# EAGLE design Transport (EAGLE 9.4.2)
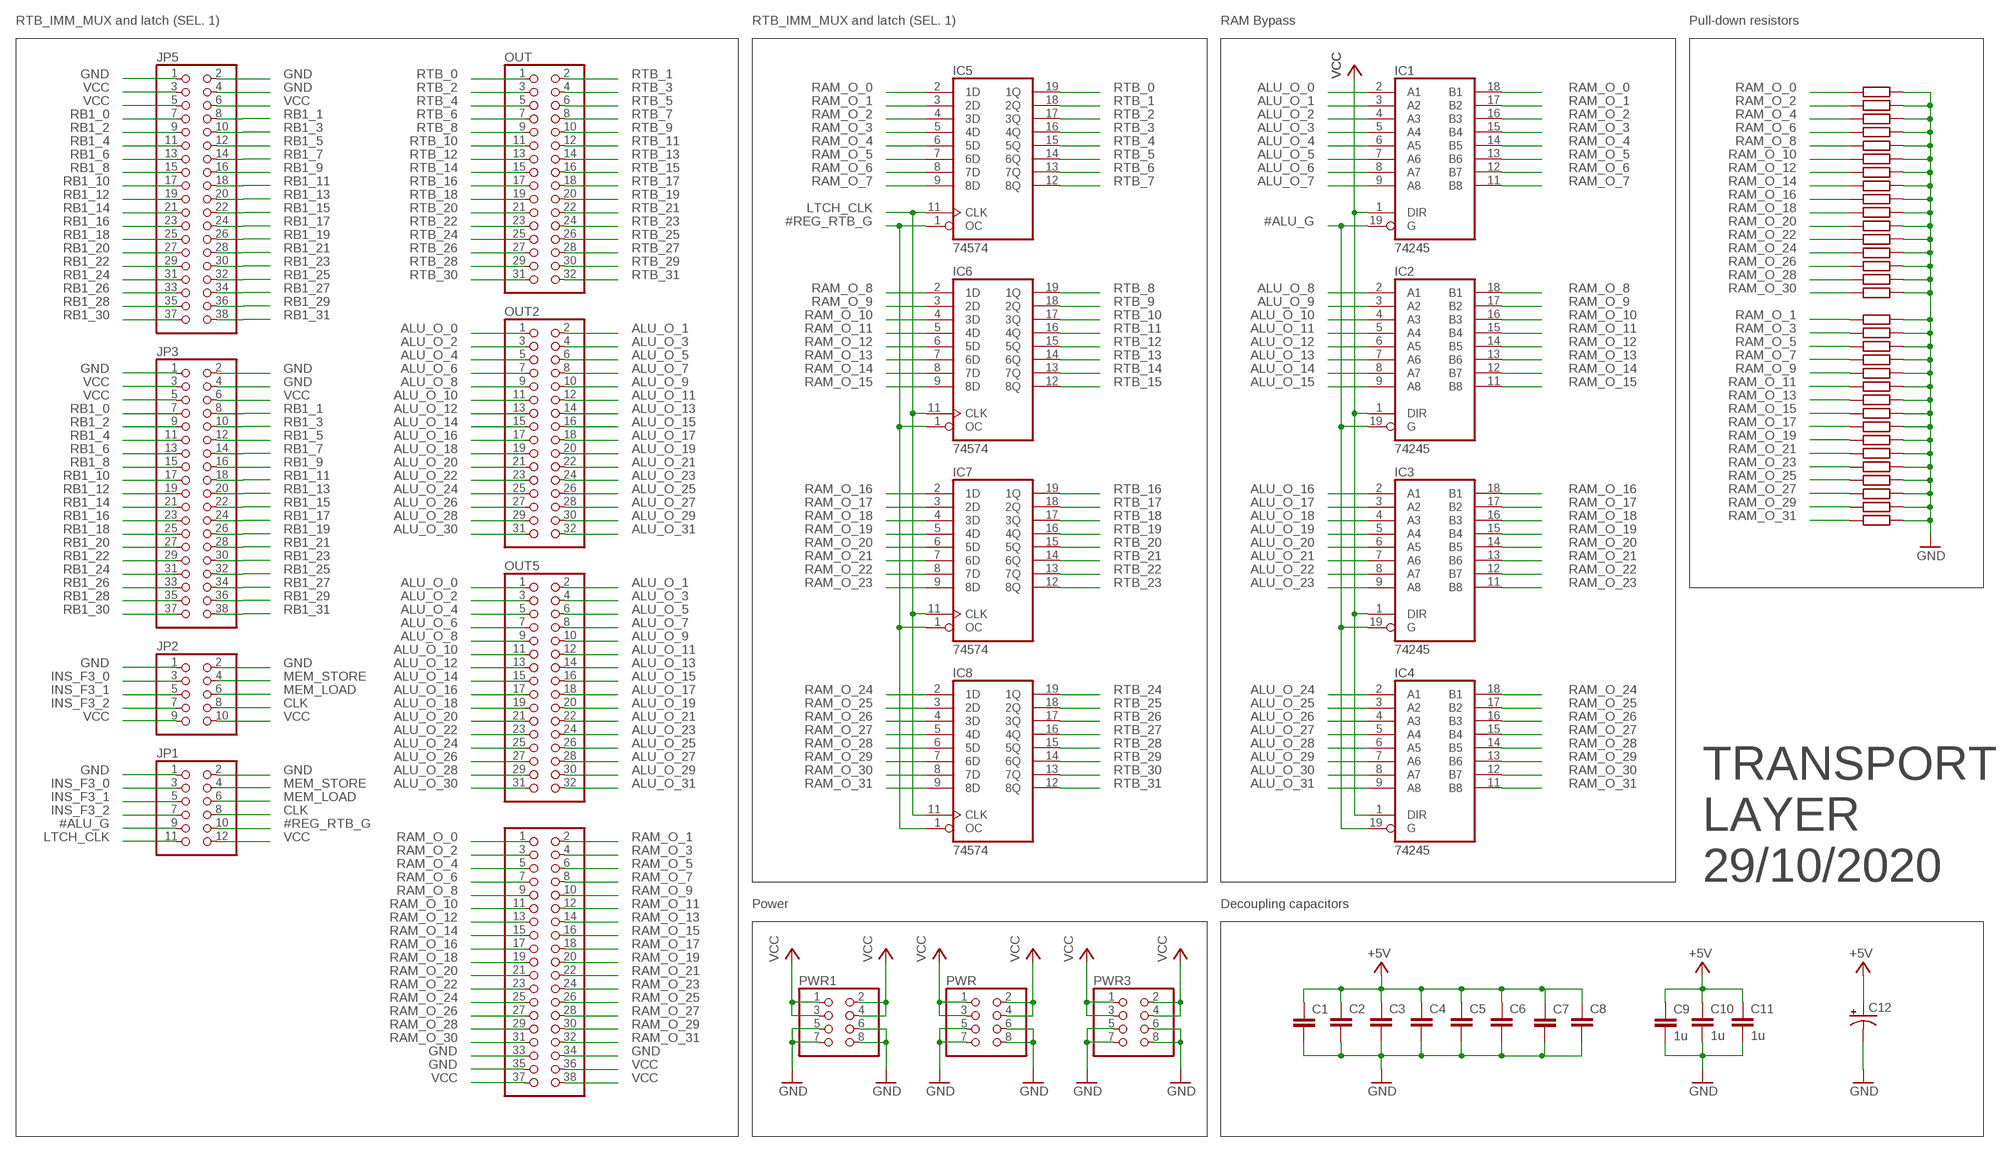
[diagram p0: schematic, sheet 1]

## Parts
C1  C-EUC0805  [C0805]
C2  C-EUC0805  [C0805]
C3  C-EUC0805  [C0805]
C4  C-EUC0805  [C0805]
C5  C-EUC0805  [C0805]
C6  C-EUC0805  [C0805]
C7  C-EUC0805  [C0805]
C8  C-EUC0805  [C0805]
C9  1u  C-EUC0805  [C0805]
C10  1u  C-EUC0805  [C0805]
C11  1u  C-EUC0805  [C0805]
C12  CAPACITOR-P153CLV-1010  [153CLV-1010]
IC1  74245  [TSSOP20]
IC2  74245  [TSSOP20]
IC3  74245  [TSSOP20]
IC4  74245  [TSSOP20]
IC5  74574  [TSSOP20]
IC6  74574  [TSSOP20]
IC7  74574  [TSSOP20]
IC8  74574  [TSSOP20]
JP1  PINHD-2X6  [2X06]
JP2  PINHD-2X5  [2X05]
JP3  PINHD-2X19  [2X19]
JP4  PINHD-2X19  [2X19]
JP5  PINHD-2X19  [2X19]
OUT  PINHD-2X16  [2X16]
OUT2  PINHD-2X16  [2X16]
OUT5  PINHD-2X16  [2X16]
PWR  PINHD-2X4  [2X04]
PWR1  PINHD-2X4  [2X04]
PWR3  PINHD-2X4  [2X04]
R1  R-EU_R0805  [R0805]
R2  R-EU_R0805  [R0805]
R3  R-EU_R0805  [R0805]
R4  R-EU_R0805  [R0805]
R5  R-EU_R0805  [R0805]
R6  R-EU_R0805  [R0805]
R7  R-EU_R0805  [R0805]
R8  R-EU_R0805  [R0805]
R9  R-EU_R0805  [R0805]
R10  R-EU_R0805  [R0805]
R11  R-EU_R0805  [R0805]
R12  R-EU_R0805  [R0805]
R13  R-EU_R0805  [R0805]
R14  R-EU_R0805  [R0805]
R15  R-EU_R0805  [R0805]
R16  R-EU_R0805  [R0805]
R17  R-EU_R0805  [R0805]
R18  R-EU_R0805  [R0805]
R19  R-EU_R0805  [R0805]
R20  R-EU_R0805  [R0805]
R21  R-EU_R0805  [R0805]
R22  R-EU_R0805  [R0805]
R23  R-EU_R0805  [R0805]
R24  R-EU_R0805  [R0805]
R25  R-EU_R0805  [R0805]
R26  R-EU_R0805  [R0805]
R27  R-EU_R0805  [R0805]
R28  R-EU_R0805  [R0805]
R29  R-EU_R0805  [R0805]
R30  R-EU_R0805  [R0805]
R31  R-EU_R0805  [R0805]
R33  R-EU_R0805  [R0805]

## Nets
#ALU_G: IC1.19(G) IC2.19(G) IC3.19(G) IC4.19(G) JP1.9
#REG_RTB_G: IC5.1(OC) IC6.1(OC) IC7.1(OC) IC8.1(OC) JP1.10
ALU_O_0: IC1.2(A1) OUT2.1 OUT5.1
ALU_O_1: IC1.3(A2) OUT2.2 OUT5.2
ALU_O_2: IC1.4(A3) OUT2.3 OUT5.3
ALU_O_3: IC1.5(A4) OUT2.4 OUT5.4
ALU_O_4: IC1.6(A5) OUT2.5 OUT5.5
ALU_O_5: IC1.7(A6) OUT2.6 OUT5.6
ALU_O_6: IC1.8(A7) OUT2.7 OUT5.7
ALU_O_7: IC1.9(A8) OUT2.8 OUT5.8
ALU_O_8: IC2.2(A1) OUT2.9 OUT5.9
ALU_O_9: IC2.3(A2) OUT2.10 OUT5.10
ALU_O_10: IC2.4(A3) OUT2.11 OUT5.11
ALU_O_11: IC2.5(A4) OUT2.12 OUT5.12
ALU_O_12: IC2.6(A5) OUT2.13 OUT5.13
ALU_O_13: IC2.7(A6) OUT2.14 OUT5.14
ALU_O_14: IC2.8(A7) OUT2.15 OUT5.15
ALU_O_15: IC2.9(A8) OUT2.16 OUT5.16
ALU_O_16: IC3.2(A1) OUT2.17 OUT5.17
ALU_O_17: IC3.3(A2) OUT2.18 OUT5.18
ALU_O_18: IC3.4(A3) OUT2.19 OUT5.19
ALU_O_19: IC3.5(A4) OUT2.20 OUT5.20
ALU_O_20: IC3.6(A5) OUT2.21 OUT5.21
ALU_O_21: IC3.7(A6) OUT2.22 OUT5.22
ALU_O_22: IC3.8(A7) OUT2.23 OUT5.23
ALU_O_23: IC3.9(A8) OUT2.24 OUT5.24
ALU_O_24: IC4.2(A1) OUT2.25 OUT5.25
ALU_O_25: IC4.3(A2) OUT2.26 OUT5.26
ALU_O_26: IC4.4(A3) OUT2.27 OUT5.27
ALU_O_27: IC4.5(A4) OUT2.28 OUT5.28
ALU_O_28: IC4.6(A5) OUT2.29 OUT5.29
ALU_O_29: IC4.7(A6) OUT2.30 OUT5.30
ALU_O_30: IC4.8(A7) OUT2.31 OUT5.31
ALU_O_31: IC4.9(A8) OUT2.32 OUT5.32
CLK: JP1.8 JP2.8
GND: C1.2 C2.2 C3.2 C4.2 C5.2 C6.2 C7.2 C8.2 C9.2 C10.2 C11.2 C12.- JP1.1 JP1.2 JP2.1 JP2.2 JP3.1 JP3.2 JP3.4 JP4.33 JP4.34 JP4.35 JP5.1 JP5.2 JP5.4 PWR1.5 PWR1.6 PWR1.7 PWR1.8 PWR3.5 PWR3.6 PWR3.7 PWR3.8 PWR.5 PWR.6 PWR.7 PWR.8 R1.2 R2.2 R3.2 R4.2 R5.2 R6.2 R7.2 R8.2 R9.2 R10.2 R11.2 R12.2 R13.2 R14.2 R15.2 R16.2 R17.2 R18.2 R19.2 R20.2 R21.2 R22.2 R23.2 R24.2 R25.2 R26.2 R27.2 R28.2 R29.2 R30.2 R31.2 R33.2
INS_F3_0: JP1.3 JP2.3
INS_F3_1: JP1.5 JP2.5
INS_F3_2: JP1.7 JP2.7
LTCH_CLK: IC5.11(CLK) IC6.11(CLK) IC7.11(CLK) IC8.11(CLK) JP1.11
MEM_LOAD: JP1.6 JP2.6
MEM_STORE: JP1.4 JP2.4
RAM_O_0: IC1.18(B1) IC5.2(1D) JP4.1 R33.1
RAM_O_1: IC1.17(B2) IC5.3(2D) JP4.2 R16.1
RAM_O_2: IC1.16(B3) IC5.4(3D) JP4.3 R1.1
RAM_O_3: IC1.15(B4) IC5.5(4D) JP4.4 R17.1
RAM_O_4: IC1.14(B5) IC5.6(5D) JP4.5 R2.1
RAM_O_5: IC1.13(B6) IC5.7(6D) JP4.6 R18.1
RAM_O_6: IC1.12(B7) IC5.8(7D) JP4.7 R3.1
RAM_O_7: IC1.11(B8) IC5.9(8D) JP4.8 R19.1
RAM_O_8: IC2.18(B1) IC6.2(1D) JP4.9 R4.1
RAM_O_9: IC2.17(B2) IC6.3(2D) JP4.10 R20.1
RAM_O_10: IC2.16(B3) IC6.4(3D) JP4.11 R5.1
RAM_O_11: IC2.15(B4) IC6.5(4D) JP4.12 R21.1
RAM_O_12: IC2.14(B5) IC6.6(5D) JP4.13 R6.1
RAM_O_13: IC2.13(B6) IC6.7(6D) JP4.14 R22.1
RAM_O_14: IC2.12(B7) IC6.8(7D) JP4.15 R7.1
RAM_O_15: IC2.11(B8) IC6.9(8D) JP4.16 R23.1
RAM_O_16: IC3.18(B1) IC7.2(1D) JP4.17 R8.1
RAM_O_17: IC3.17(B2) IC7.3(2D) JP4.18 R24.1
RAM_O_18: IC3.16(B3) IC7.4(3D) JP4.19 R9.1
RAM_O_19: IC3.15(B4) IC7.5(4D) JP4.20 R25.1
RAM_O_20: IC3.14(B5) IC7.6(5D) JP4.21 R10.1
RAM_O_21: IC3.13(B6) IC7.7(6D) JP4.22 R26.1
RAM_O_22: IC3.12(B7) IC7.8(7D) JP4.23 R11.1
RAM_O_23: IC3.11(B8) IC7.9(8D) JP4.24 R27.1
RAM_O_24: IC4.18(B1) IC8.2(1D) JP4.25 R12.1
RAM_O_25: IC4.17(B2) IC8.3(2D) JP4.26 R28.1
RAM_O_26: IC4.16(B3) IC8.4(3D) JP4.27 R13.1
RAM_O_27: IC4.15(B4) IC8.5(4D) JP4.28 R29.1
RAM_O_28: IC4.14(B5) IC8.6(5D) JP4.29 R14.1
RAM_O_29: IC4.13(B6) IC8.7(6D) JP4.30 R30.1
RAM_O_30: IC4.12(B7) IC8.8(7D) JP4.31 R15.1
RAM_O_31: IC4.11(B8) IC8.9(8D) JP4.32 R31.1
RB1_0: JP3.7 JP5.7
RB1_1: JP3.8 JP5.8
RB1_2: JP3.9 JP5.9
RB1_3: JP3.10 JP5.10
RB1_4: JP3.11 JP5.11
RB1_5: JP3.12 JP5.12
RB1_6: JP3.13 JP5.13
RB1_7: JP3.14 JP5.14
RB1_8: JP3.15 JP5.15
RB1_9: JP3.16 JP5.16
RB1_10: JP3.17 JP5.17
RB1_11: JP3.18 JP5.18
RB1_12: JP3.19 JP5.19
RB1_13: JP3.20 JP5.20
RB1_14: JP3.21 JP5.21
RB1_15: JP3.22 JP5.22
RB1_16: JP3.23 JP5.23
RB1_17: JP3.24 JP5.24
RB1_18: JP3.25 JP5.25
RB1_19: JP3.26 JP5.26
RB1_20: JP3.27 JP5.27
RB1_21: JP3.28 JP5.28
RB1_22: JP3.29 JP5.29
RB1_23: JP3.30 JP5.30
RB1_24: JP3.31 JP5.31
RB1_25: JP3.32 JP5.32
RB1_26: JP3.33 JP5.33
RB1_27: JP3.34 JP5.34
RB1_28: JP3.35 JP5.35
RB1_29: JP3.36 JP5.36
RB1_30: JP3.37 JP5.37
RB1_31: JP3.38 JP5.38
RTB_0: IC5.19(1Q) OUT.1
RTB_1: IC5.18(2Q) OUT.2
RTB_2: IC5.17(3Q) OUT.3
RTB_3: IC5.16(4Q) OUT.4
RTB_4: IC5.15(5Q) OUT.5
RTB_5: IC5.14(6Q) OUT.6
RTB_6: IC5.13(7Q) OUT.7
RTB_7: IC5.12(8Q) OUT.8
RTB_8: IC6.19(1Q) OUT.9
RTB_9: IC6.18(2Q) OUT.10
RTB_10: IC6.17(3Q) OUT.11
RTB_11: IC6.16(4Q) OUT.12
RTB_12: IC6.15(5Q) OUT.13
RTB_13: IC6.14(6Q) OUT.14
RTB_14: IC6.13(7Q) OUT.15
RTB_15: IC6.12(8Q) OUT.16
RTB_16: IC7.19(1Q) OUT.17
RTB_17: IC7.18(2Q) OUT.18
RTB_18: IC7.17(3Q) OUT.19
RTB_19: IC7.16(4Q) OUT.20
RTB_20: IC7.15(5Q) OUT.21
RTB_21: IC7.14(6Q) OUT.22
RTB_22: IC7.13(7Q) OUT.23
RTB_23: IC7.12(8Q) OUT.24
RTB_24: IC8.19(1Q) OUT.25
RTB_25: IC8.18(2Q) OUT.26
RTB_26: IC8.17(3Q) OUT.27
RTB_27: IC8.16(4Q) OUT.28
RTB_28: IC8.15(5Q) OUT.29
RTB_29: IC8.14(6Q) OUT.30
RTB_30: IC8.13(7Q) OUT.31
RTB_31: IC8.12(8Q) OUT.32
VCC: C1.1 C2.1 C3.1 C4.1 C5.1 C6.1 C7.1 C8.1 C9.1 C10.1 C11.1 C12.+ IC1.1(DIR) IC2.1(DIR) IC3.1(DIR) IC4.1(DIR) JP1.12 JP2.9 JP2.10 JP3.3 JP3.5 JP3.6 JP4.36 JP4.37 JP4.38 JP5.3 JP5.5 JP5.6 PWR1.1 PWR1.2 PWR1.3 PWR1.4 PWR3.1 PWR3.2 PWR3.3 PWR3.4 PWR.1 PWR.2 PWR.3 PWR.4 ; supply symbol labelled +5V

## Notes on the sheet
- RTB_IMM_MUX and latch (SEL. 1) | RTB_IMM_MUX and latch (SEL. 1) | RAM Bypass | Pull-down resistors
- TRANSPORT
  LAYER
  29/10/2020
- Power | Decoupling capacitors

## Power pins joined to a net without a drawn wire
GND: IC1.10(GND) IC2.10(GND) IC3.10(GND) IC4.10(GND) IC5.10(GND) IC6.10(GND) IC7.10(GND) IC8.10(GND)
VCC: IC1.20(VCC) IC2.20(VCC) IC3.20(VCC) IC4.20(VCC) IC5.20(VCC) IC6.20(VCC) IC7.20(VCC) IC8.20(VCC)

## Library data of the parts
C1-C11 = rcl:C-EU: CAPACITOR, European symbol; SPICEPREFIX: C
C12 = BeagleBone_Blue_R3:CAPACITOR-P: POLARIZED CAPACITOR, American symbol
IC1-IC4 = AAA__74xx-eu:74*245: Octal BUS TRANSCEIVER, 3-state
IC5-IC8 = AAA__74xx-eu:74*574: 8-bit D type FLIP FLOP bus driver
JP1 = pinhead_bottom:PINHD-2X6: PIN HEADER
JP2 = Connector:PINHD-2X5: PIN HEADER; CATEGORY: CONNECTOR; SUB-CATEGORY: PIN-HEADER
JP3 = pinhead_bottom:PINHD-2X19: PIN HEADER
JP4 JP5 = pinhead:PINHD-2X19: PIN HEADER
OUT OUT5 = pinhead_bottom:PINHD-2X16: PIN HEADER
OUT2 = pinhead:PINHD-2X16: PIN HEADER
PWR PWR3 = pinhead_bottom:PINHD-2X4: PIN HEADER
PWR1 = pinhead:PINHD-2X4: PIN HEADER
R1-R31 R33 = rcl:R-EU_: RESISTOR, European symbol; SPICEPREFIX: R

## Board
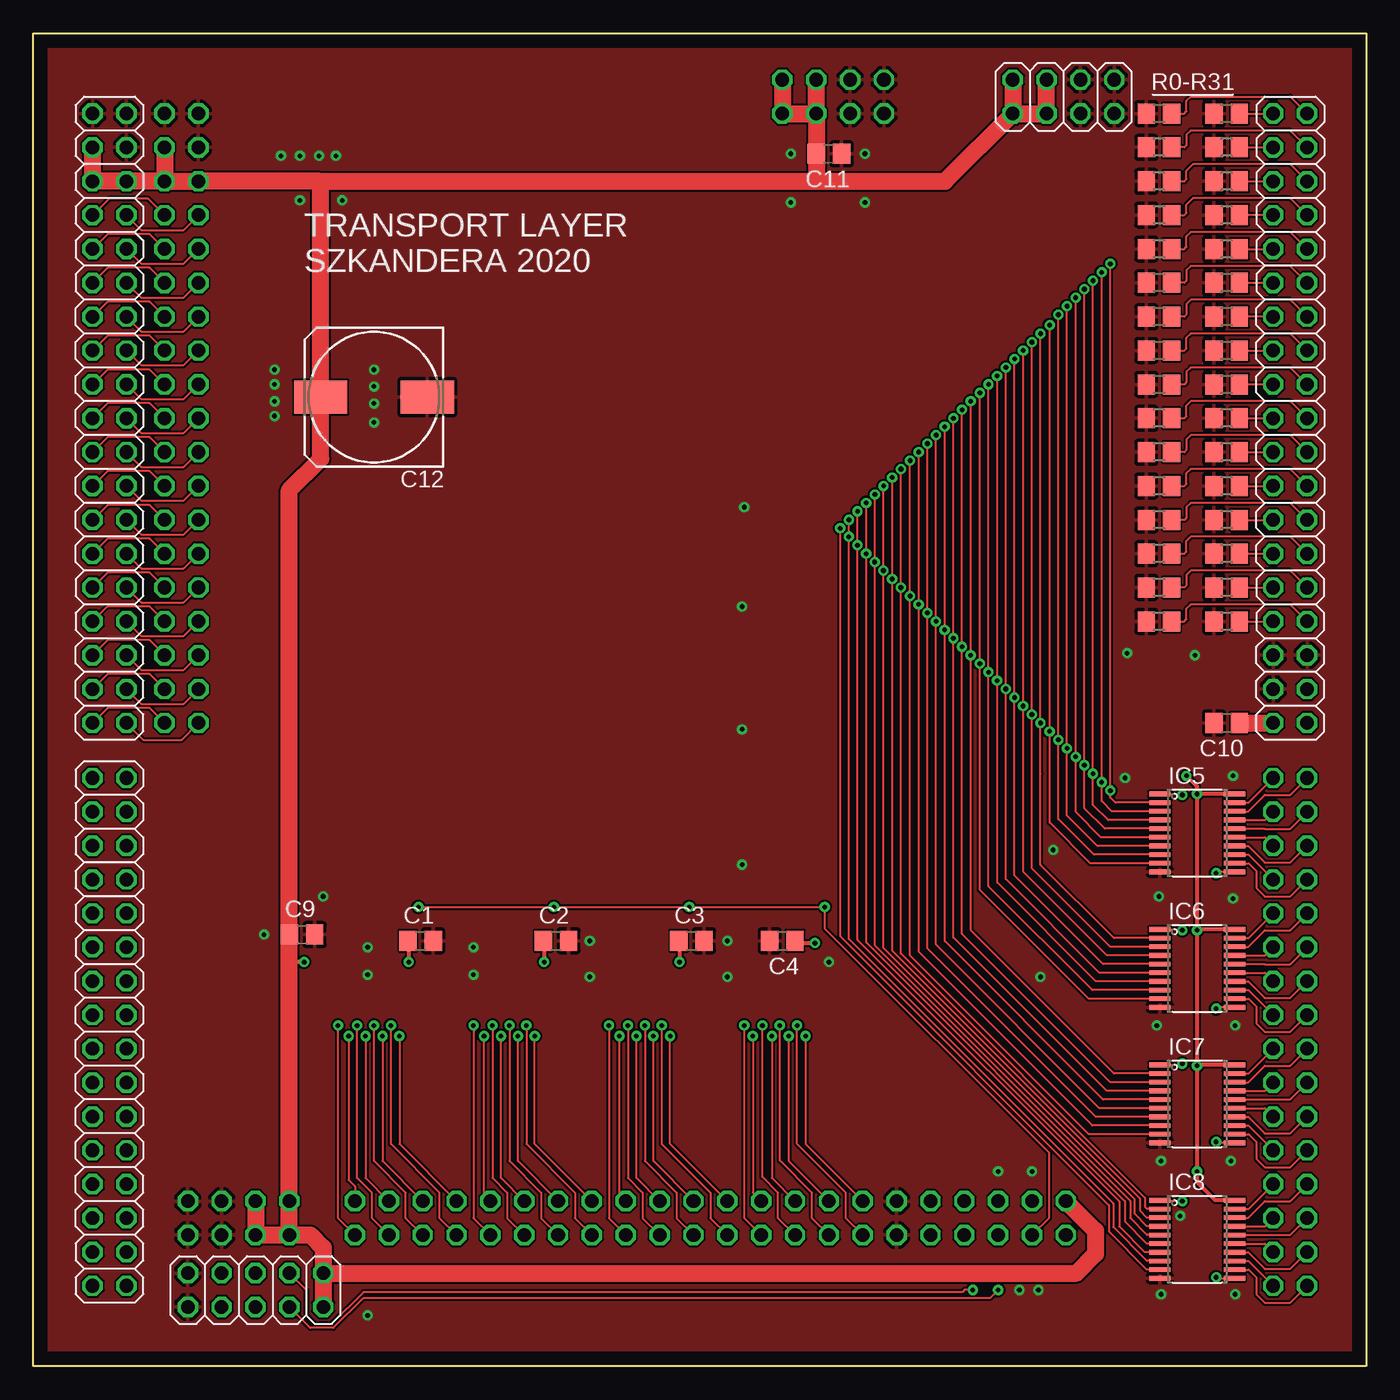
[diagram p1: board, top side]
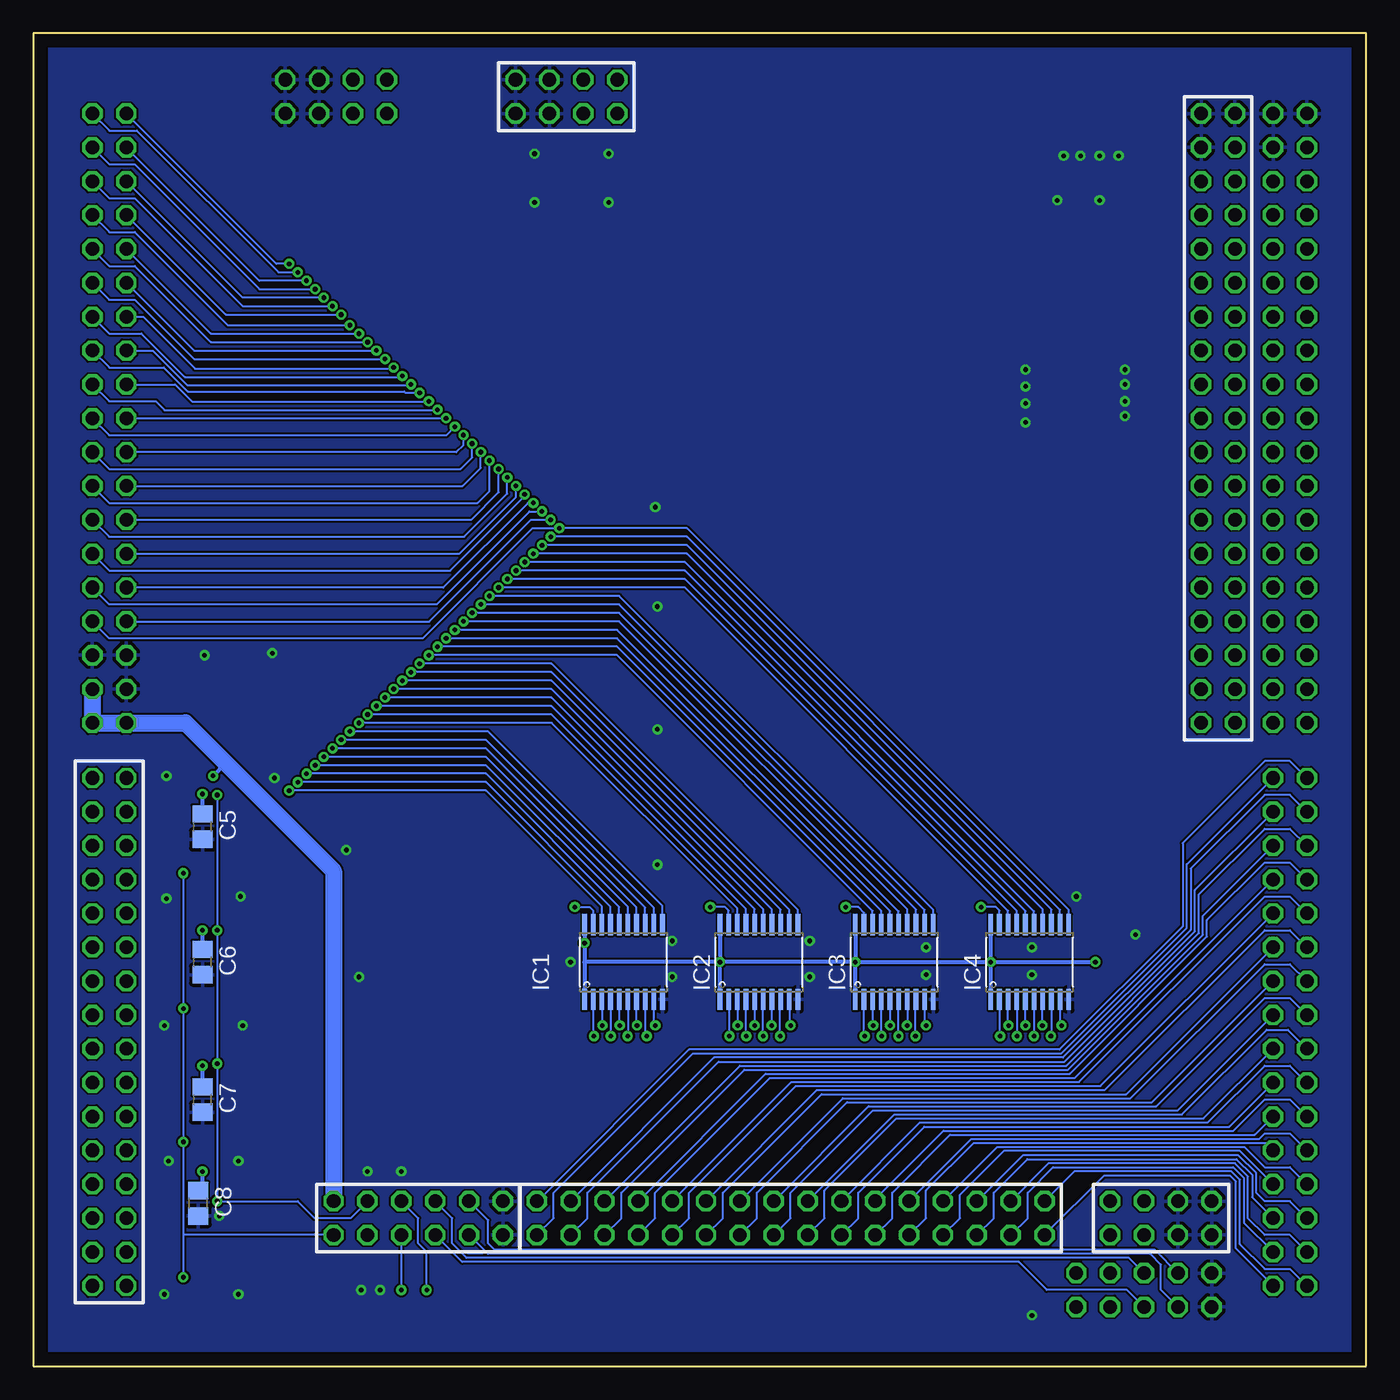
[diagram p2: board, bottom side, seen from below]

Size 100 x 100 mm. Coordinates in mm from the lower left corner, seen from the top.
Outline: 0,0 0,100 100,100 100,0 0,0
Copper layers (1*16): Top 0.035mm / dielectric 1.5mm / Bottom 0.035mm
Design rules "default": minimum track width 6mil, minimum drill 0.35mm, track to track 6mil, track to pad 6mil, pad to pad 6mil, via to via 6mil, smd to smd 6mil, copper to edge 40mil, drill to drill 6mil, minimum pad ring 10mil, minimum via ring 8mil, stop-mask expansion 4mil, vias tented up to drill 0mil, thermal gap 10mil

### Footprints (pad centres in the part's own frame; a part is rotated, then mirrored left to right if it is on the bottom)
C0805 = smd 1.3 x 1.5: 1 -0.95,0; 2 0.95,0
153CLV-1010 = smd 4 x 2.5: + 4,0; - -4,0
TSSOP20 = smd 0.35 x 1.6: 1 -2.925,-2.8; 2 -2.275,-2.8; 3 -1.625,-2.8; 4 -0.975,-2.8; 5 -0.325,-2.8; 6 0.325,-2.8; 7 0.975,-2.8; 8 1.625,-2.8; 9 2.275,-2.8; 10 2.925,-2.8; 11 2.925,2.8; 12 2.275,2.8; 13 1.625,2.8; 14 0.975,2.8; 15 0.325,2.8; 16 -0.325,2.8; 17 -0.975,2.8; 18 -1.625,2.8; 19 -2.275,2.8; 20 -2.925,2.8
2X06 = drill 1.016 octagon: 1 -6.35,-1.27; 2 -6.35,1.27; 3 -3.81,-1.27; 4 -3.81,1.27; 5 -1.27,-1.27; 6 -1.27,1.27; 7 1.27,-1.27; 8 1.27,1.27; 9 3.81,-1.27; 10 3.81,1.27; 11 6.35,-1.27; 12 6.35,1.27
2X05 = drill 1.016 octagon: 1 -5.08,-1.27; 2 -5.08,1.27; 3 -2.54,-1.27; 4 -2.54,1.27; 5 0,-1.27; 6 0,1.27; 7 2.54,-1.27; 8 2.54,1.27; 9 5.08,-1.27; 10 5.08,1.27
2X19 = drill 1.016 octagon: 1 -22.86,-1.27; 2 -22.86,1.27; 3 -20.32,-1.27; 4 -20.32,1.27; 5 -17.78,-1.27; 6 -17.78,1.27; 7 -15.24,-1.27; 8 -15.24,1.27; 9 -12.7,-1.27; 10 -12.7,1.27; 11 -10.16,-1.27; 12 -10.16,1.27; 13 -7.62,-1.27; 14 -7.62,1.27; 15 -5.08,-1.27; 16 -5.08,1.27; 17 -2.54,-1.27; 18 -2.54,1.27; 19 0,-1.27; 20 0,1.27; 21 2.54,-1.27; 22 2.54,1.27; 23 5.08,-1.27; 24 5.08,1.27; 25 7.62,-1.27; 26 7.62,1.27; 27 10.16,-1.27; 28 10.16,1.27; 29 12.7,-1.27; 30 12.7,1.27; 31 15.24,-1.27; 32 15.24,1.27; 33 17.78,-1.27; 34 17.78,1.27; 35 20.32,-1.27; 36 20.32,1.27; 37 22.86,-1.27; 38 22.86,1.27
2X16 = drill 1.016 octagon: 1 -19.05,-1.27; 2 -19.05,1.27; 3 -16.51,-1.27; 4 -16.51,1.27; 5 -13.97,-1.27; 6 -13.97,1.27; 7 -11.43,-1.27; 8 -11.43,1.27; 9 -8.89,-1.27; 10 -8.89,1.27; 11 -6.35,-1.27; 12 -6.35,1.27; 13 -3.81,-1.27; 14 -3.81,1.27; 15 -1.27,-1.27; 16 -1.27,1.27; 17 1.27,-1.27; 18 1.27,1.27; 19 3.81,-1.27; 20 3.81,1.27; 21 6.35,-1.27; 22 6.35,1.27; 23 8.89,-1.27; 24 8.89,1.27; 25 11.43,-1.27; 26 11.43,1.27; 27 13.97,-1.27; 28 13.97,1.27; 29 16.51,-1.27; 30 16.51,1.27; 31 19.05,-1.27; 32 19.05,1.27
2X04 = drill 1.016 octagon: 1 -3.81,-1.27; 2 -3.81,1.27; 3 -1.27,-1.27; 4 -1.27,1.27; 5 1.27,-1.27; 6 1.27,1.27; 7 3.81,-1.27; 8 3.81,1.27
R0805 = smd 1.3 x 1.5: 1 -0.95,0; 2 0.95,0

### Placement (x,y rotation side)
C1  29.05,31.91 0 top
C2  39.21,31.91 0 top
C3  49.37,31.91 0 top
C4  56.2,31.91 180 top
C5  87.31,40.48 270 bottom
C6  87.31,30.32 270 bottom
C7  87.31,20 270 bottom
C8  87.63,12.22 270 bottom
C9  20.16,32.38 0 top
C10  89.53,48.26 180 top
C11  59.69,90.96 0 top
C12  25.56,72.71 180 top
IC1  55.72,30.32 0 bottom
IC2  45.56,30.32 0 bottom
IC3  35.4,30.32 0 bottom
IC4  25.24,30.32 0 bottom
IC5  87.31,40.01 270 top
IC6  87.31,29.84 270 top
IC7  87.31,19.68 270 top
IC8  87.31,9.53 270 top
JP1  71.12,11.11 0 top
JP2  16.67,5.71 0 top
JP3  11.11,71.12 270 top
JP4  94.3,71.12 270 top
JP5  5.71,71.12 270 top
OUT  94.3,25.08 270 top
OUT2  5.71,25.08 270 top
OUT5  43.18,11.11 180 top
PWR  15.4,11.11 180 top
PWR1  77.29,95.25 0 top
PWR3  60.01,95.25 0 top
R1  89.53,91.44 180 top
R2  89.53,88.9 180 top
R3  89.53,86.36 180 top
R4  89.53,83.82 180 top
R5  89.53,81.28 180 top
R6  89.53,78.74 180 top
R7  89.53,76.2 180 top
R8  89.53,73.66 180 top
R9  89.53,71.12 180 top
R10  89.53,68.58 180 top
R11  89.53,66.04 180 top
R12  89.53,63.5 180 top
R13  89.53,60.96 180 top
R14  89.53,58.42 180 top
R15  89.53,55.88 180 top
R16  84.45,93.98 180 top
R17  84.45,91.44 180 top
R18  84.45,88.9 180 top
R19  84.45,86.36 180 top
R20  84.45,83.82 180 top
R21  84.45,81.28 180 top
R22  84.45,78.74 180 top
R23  84.45,76.2 180 top
R24  84.45,73.66 180 top
R25  84.45,71.12 180 top
R26  84.45,68.58 180 top
R27  84.45,66.04 180 top
R28  84.45,63.5 180 top
R29  84.45,60.96 180 top
R30  84.45,58.42 180 top
R31  84.45,55.88 180 top
R33  89.53,93.98 180 top

### Tracks (layer width: path | path; a pad name or v marks a point on that pad's centre or on a via)
#ALU_G  (via drill 0.35)
  Top 0.152: v28.89,34.45 v39.05,34.45 v49.21,34.45 v59.37,34.45 59.37,32.86 76.2,16.03 76.2,11.11 JP1.9
  Bottom 0.152: IC4.19 27.52,34.18 27.78,34.45 v28.89,34.45 | v59.37,34.45 58.26,34.45 58,34.18 IC1.19 | IC2.19 47.84,34.18 48.1,34.45 v49.21,34.45 | IC3.19 37.68,34.02 38.1,34.45 v39.05,34.45
#REG_RTB_G  (via drill 0.35)
  Top 0.152: IC5.1 86.13,42.93 v86.2,42.86 | v86.2,12.38 84.58,12.38 IC8.1 | IC7.1 86.11,22.61 v86.2,22.7 | IC6.1 86.13,32.77 v86.2,32.7
  Bottom 0.152: v86.2,42.86 v86.2,32.7 v86.2,22.7 v86.2,12.38 80.17,12.38 78.9,11.11 76.2,11.11 JP1.10
ALU_O_0  (via drill 0.35)
  Top 0.152: v57.94,24.77 57.94,16.67 OUT5.1
  Bottom 0.152: OUT2.1 5.71,45.4 7.62,45.4 13.77,39.26 13.77,33 23,23.76 50.81,23.76 62.19,12.38 OUT5.1 | IC1.2 58,24.82 v57.94,24.77
ALU_O_1  (via drill 0.35)
  Top 0.152: OUT5.2 60.96,11.11 60.96,13.02 57.31,16.67 v57.31,25.56
  Bottom 0.152: OUT5.2 60.96,11.11 60.96,13.02 50.52,23.46 22.88,23.46 13.46,32.87 13.46,37.66 OUT2.2 | v57.31,25.56 57.31,27.48 IC1.3
ALU_O_2  (via drill 0.35)
  Top 0.152: v56.67,24.77 56.67,15.4 OUT5.3
  Bottom 0.152: OUT2.3 5.71,42.86 7.62,42.86 13.16,37.33 13.16,32.75 22.75,23.15 48.92,23.15 OUT5.3 | IC1.4 56.7,24.79 v56.67,24.77
ALU_O_3  (via drill 0.35)
  Top 0.152: OUT5.4 58.42,11.11 58.42,13.02 56,15.43 56,24.51 56.01,24.51 56.01,25.02 56,25.02 v56,25.56
  Bottom 0.152: OUT5.4 58.42,11.11 58.42,13.02 48.59,22.85 22.63,22.85 12.85,32.62 12.85,35.73 OUT2.4 | v56,25.56 56,27.48 IC1.5
ALU_O_4  (via drill 0.35)
  Top 0.152: v55.4,24.77 55.4,14.13 OUT5.5
  Bottom 0.152: OUT5.5 46.99,22.54 22.5,22.54 12.55,32.49 12.55,35.4 7.62,40.32 5.71,40.32 OUT2.5 | IC1.6 v55.4,24.77
ALU_O_5  (via drill 0.35)
  Top 0.152: OUT5.6 55.88,11.11 55.88,13.02 54.7,14.19 v54.7,25.56
  Bottom 0.152: OUT5.6 55.88,11.11 55.88,13.02 46.66,22.24 22.37,22.24 12.24,32.37 12.24,33.8 OUT2.6 | v54.7,25.56 54.75,25.6 IC1.7
ALU_O_6  (via drill 0.35)
  Top 0.152: v53.98,24.77 53.98,13.02 OUT5.7
  Bottom 0.152: OUT5.7 45.06,21.93 22.25,21.93 11.94,32.24 11.94,33.47 7.62,37.78 5.71,37.78 OUT2.7 | IC1.8 54.1,24.89 v53.98,24.77
ALU_O_7  (via drill 0.35)
  Top 0.152: OUT5.8 53.34,11.11 v53.34,25.56
  Bottom 0.152: OUT5.8 53.34,11.11 53.34,13.02 44.73,21.63 21.87,21.63 OUT2.8 | v53.34,25.56 53.45,25.66 IC1.9
ALU_O_8  (via drill 0.35)
  Top 0.152: OUT5.9 47.78,16.67 v47.78,24.77
  Bottom 0.152: OUT5.9 43.13,21.32 21.54,21.32 7.62,35.24 5.71,35.24 OUT2.9 | v47.78,24.77 47.78,27.47 IC2.2
ALU_O_9  (via drill 0.35)
  Top 0.152: v47.15,25.56 47.15,16.67 50.8,13.02 50.8,11.11 OUT5.10
  Bottom 0.152: OUT5.10 50.8,11.11 50.8,13.02 42.8,21.02 19.94,21.02 OUT2.10 | IC2.3 47.19,25.6 v47.15,25.56
ALU_O_10  (via drill 0.35)
  Top 0.152: OUT5.11 46.51,15.4 v46.51,24.77
  Bottom 0.152: OUT5.11 41.2,20.71 19.61,20.71 7.62,32.7 5.71,32.7 OUT2.11 | v46.51,24.77 46.51,27.5 IC2.4
ALU_O_11  (via drill 0.35)
  Top 0.152: v45.88,25.56 45.88,15.4 48.26,13.02 48.26,11.11 OUT5.12
  Bottom 0.152: OUT5.12 48.26,11.11 48.26,13.02 40.87,20.41 18.01,20.41 OUT2.12 | IC2.5 45.89,25.73 45.88,25.72 v45.88,25.56
ALU_O_12  (via drill 0.35)
  Top 0.152: OUT5.13 45.24,14.13 v45.24,24.77
  Bottom 0.152: OUT5.13 39.27,20.1 17.68,20.1 7.62,30.16 5.71,30.16 OUT2.13 | v45.24,24.77 IC2.6
ALU_O_13  (via drill 0.35)
  Top 0.152: v44.61,25.56 44.61,14.13 45.72,13.02 45.72,11.11 OUT5.14
  Bottom 0.152: OUT5.14 45.72,11.11 45.72,13.02 38.94,19.8 16.08,19.8 OUT2.14 | IC2.7 44.61,27.5 v44.61,25.56
ALU_O_14  (via drill 0.35)
  Top 0.152: OUT5.15 43.97,12.86 v43.97,24.77
  Bottom 0.152: OUT5.15 37.34,19.49 15.75,19.49 7.62,27.62 5.71,27.62 OUT2.15 | v43.97,24.77 43.97,27.48 IC2.8
ALU_O_15  (via drill 0.35)
  Top 0.152: v43.18,25.56 43.18,11.11 OUT5.16
  Bottom 0.152: OUT5.16 43.18,11.11 43.18,13.02 37.01,19.19 14.15,19.19 OUT2.16 | IC2.9 43.29,25.66 v43.18,25.56
ALU_O_16  (via drill 0.35)
  Top 0.152: OUT5.17 37.62,16.67 v37.62,24.77
  Bottom 0.152: OUT5.17 35.41,18.89 13.82,18.89 7.46,25.24 5.87,25.24 OUT2.17 | v37.62,24.77 37.68,24.82 IC3.2
ALU_O_17  (via drill 0.35)
  Top 0.152: v36.99,25.56 36.99,16.67 40.64,13.02 40.64,11.11 OUT5.18
  Bottom 0.152: OUT5.18 40.64,11.11 40.64,13.18 35.24,18.58 12.22,18.58 OUT2.18 | IC3.3 37.03,25.6 v36.99,25.56
ALU_O_18  (via drill 0.35)
  Top 0.152: OUT5.19 36.35,15.4 v36.35,24.77
  Bottom 0.152: OUT5.19 33.48,18.27 11.89,18.27 7.62,22.54 5.71,22.54 OUT2.19 | v36.35,24.77 36.38,24.79 IC3.4
ALU_O_19  (via drill 0.35)
  Top 0.152: v35.72,25.56 35.72,15.4 38.1,13.02 38.1,11.11 OUT5.20
  Bottom 0.152: OUT5.20 38.1,11.11 38.1,13.02 33.15,17.97 10.29,17.97 OUT2.20 | IC3.5 v35.73,25.57 v35.72,25.56
ALU_O_20  (via drill 0.35)
  Top 0.152: OUT5.21 35.08,14.13 v35.08,24.77
  Bottom 0.152: OUT5.21 36.83,12.54 31.71,17.67 9.96,17.67 7.62,20 5.71,20 OUT2.21 | v35.08,24.77 IC3.6
ALU_O_21  (via drill 0.35)
  Top 0.152: v34.45,25.56 34.45,14.13 35.56,13.02 35.56,11.11 OUT5.22
  Bottom 0.152: OUT5.22 35.56,11.11 35.56,13.02 31.22,17.36 8.36,17.36 OUT2.22 | IC3.7 34.43,25.58 v34.45,25.56
ALU_O_22  (via drill 0.35)
  Top 0.152: OUT5.23 33.81,12.86 v33.81,24.77
  Bottom 0.152: OUT5.23 29.62,17.06 8.03,17.06 7.62,17.46 5.71,17.46 OUT2.23 | v33.81,24.77 33.81,27.48 IC3.8
ALU_O_23  (via drill 0.35)
  Top 0.152: v33.02,25.56 33.02,11.11 OUT5.24
  Bottom 0.152: OUT5.24 33.02,11.11 33.02,13.18 29.45,16.75 7.54,16.75 OUT2.24 | IC3.9 33.13,25.66 v33.02,25.56
ALU_O_24  (via drill 0.35)
  Top 0.152: v27.46,24.77 27.46,16.67 OUT5.25
  Bottom 0.152: OUT5.25 27.69,16.45 9.14,16.45 7.62,14.92 5.71,14.92 OUT2.25 | IC4.2 27.52,24.82 v27.46,24.77
ALU_O_25  (via drill 0.35)
  Top 0.152: OUT5.26 30.48,11.11 30.48,13.02 26.83,16.67 v26.83,25.56
  Bottom 0.152: OUT5.26 30.48,11.11 30.48,12.86 28.5,14.84 27.2,16.14 9.47,16.14 OUT2.26 | v26.83,25.56 26.87,25.6 IC4.3
ALU_O_26  (via drill 0.35)
  Top 0.152: v26.19,24.77 26.19,15.4 OUT5.27
  Bottom 0.152: OUT5.27 25.76,15.84 9.6,15.84 8.26,14.49 8.26,13.02 7.62,12.38 5.71,12.38 OUT2.27 | IC4.4 26.22,24.79 v26.19,24.77
ALU_O_27  (via drill 0.35)
  Top 0.152: OUT5.28 27.94,11.11 27.94,13.02 25.56,15.4 v25.56,25.56
  Bottom 0.152: OUT5.28 27.94,11.11 27.94,13.02 25.43,15.53 9.73,15.53 8.56,14.37 8.56,12.69 OUT2.28 | v25.56,25.56 IC4.5
ALU_O_28  (via drill 0.35)
  Top 0.152: v24.92,24.77 24.92,14.13 OUT5.29
  Bottom 0.152: OUT5.29 23.82,15.23 9.85,15.23 8.87,14.24 8.87,11.09 7.62,9.84 5.71,9.84 OUT2.29 | IC4.6 v24.92,24.77
ALU_O_29  (via drill 0.35)
  Top 0.152: OUT5.30 25.4,11.11 25.4,13.02 24.29,14.13 v24.29,25.56
  Bottom 0.152: OUT5.30 25.4,11.11 25.4,13.02 23.5,14.92 9.98,14.92 9.17,14.11 9.17,10.76 OUT2.30 | v24.29,25.56 24.29,27.5 IC4.7
ALU_O_30  (via drill 0.35)
  Top 0.152: v23.65,24.77 23.65,13.97 24.13,13.49 OUT5.31
  Bottom 0.152: OUT5.31 21.89,14.62 10.11,14.62 9.47,13.99 9.47,9.16 7.62,7.3 5.71,7.3 OUT2.31 | IC4.8 23.62,24.8 v23.65,24.77
ALU_O_31  (via drill 0.35)
  Top 0.152: OUT5.32 22.86,11.11 v22.86,25.56
  Bottom 0.152: OUT2.32 9.78,8.83 9.78,13.86 10.23,14.31 19.66,14.31 OUT5.32 | IC4.9 22.97,25.66 v22.86,25.56
CLK  (via drill 0.35)
  Top 0.152: JP2.8 20.48,5.71 20.48,3.81 21.11,3.17 22.38,3.17 24.77,5.56 69.69,5.56 69.85,5.71 v70.48,5.71
  Bottom 0.152: JP1.8 71.12,11.11 71.12,9.21 70.48,8.57 v70.48,5.71
GND  (via drill 0.35)
  other vias: 25.08,3.81 17.3,32.38 21.75,35.24 25.08,31.43 25.08,29.37 33.02,31.43 33.02,29.37 41.75,31.91 41.75,29.21 52.07,31.91 52.07,29.21 59.69,30.32 53.34,64.45 53.18,56.99 53.18,47.78 53.18,37.62 25.56,74.77 25.56,73.5 25.56,72.23 25.56,70.8 18.1,74.77 18.1,73.66 18.1,72.39 18.1,71.28 18.57,90.81 20,90.81 21.43,90.81 22.7,90.81 23.18,87.47 20,87.47 56.83,90.96 62.39,90.96 56.83,87.31 62.39,87.31 90.01,44.29 81.92,44.13 84.45,35.24 90.01,35.08 84.3,25.56 90.17,25.56 84.61,15.4 89.85,15.4 90.17,5.4 84.61,5.4 73.98,5.71 75.41,5.71 72.39,14.61 74.93,14.61 86.04,11.27 75.56,29.21 76.52,38.73 82.07,53.5 87.15,53.34
  pour Bottom: 106.05,104.78 106.05,-7.62 10.16,-7.62 -3.81,-7.62 -3.81,95.09 -3.81,104.78
  pour Top: 107.31,105.41 107.31,-8.26 32.38,-8.26 -5.4,-8.26 -5.4,79.38 -5.4,105.41
INS_F3_0
  Bottom 0.152: JP2.3 15.4,5.71 15.4,7.62 16.2,8.43 65.89,8.43 JP1.3
INS_F3_1
  Bottom 0.152: JP2.5 17.94,5.71 23.97,5.71 26.07,7.82 67.82,7.82 JP1.5
INS_F3_2  (via drill 0.35)
  Top 0.152: v72.39,5.71 71.78,5.11 24.75,5.11 22.51,2.87 20.78,2.87 JP2.7
  Bottom 0.152: JP1.7 v72.39,5.71
LTCH_CLK  (via drill 0.35)
  Top 0.152: IC5.11 88.83,37.08 v88.74,36.99 | v88.74,6.67 88.81,6.6 IC8.11 | IC7.11 88.81,16.76 v88.74,16.83 | IC6.11 88.83,26.92 v88.74,26.83
  Bottom 0.152: v88.74,36.99 v88.74,26.83 v88.74,16.83 88.74,9.84 | 88.74,9.84 v88.74,6.67 | JP1.11 88.74,9.84
MEM_LOAD
  Bottom 0.152: JP2.6 17.8,8.12 67.49,8.12 68.58,9.21 68.58,11.11 JP1.6
MEM_STORE
  Bottom 0.152: JP2.4 15.88,8.73 65.41,8.73 65.88,9.21 65.88,10.95 JP1.4
RAM_O_0  (via drill 0.35)
  Top 0.152: IC5.2 81.19,42.28 80.8,42.66 v80.8,43.18 v80.8,82.71 | v80.8,82.71 | R33.1 JP4.1
  Bottom 0.152: IC1.18 57.35,34.49 66.04,43.18 v80.8,43.18 | v80.8,82.71 81.77,82.71 93.03,93.97 JP4.1
RAM_O_1  (via drill 0.35)
  Top 0.152: IC5.3 80.92,41.63 80.15,42.39 v80.15,43.81 | v80.15,43.81 v80.15,82.07 | R16.1 86.36,93.98 86.52,94.14 86.52,94.93 86.84,95.25 94.3,95.25 JP4.2 | v80.15,43.81 | v80.15,82.07
  Bottom 0.152: IC1.17 56.7,34.47 66.04,43.81 v80.15,43.81 | v80.15,82.07 81.6,82.07 92.23,92.71 94.31,92.71 94.31,92.72 JP4.2
RAM_O_2  (via drill 0.35)
  Top 0.152: IC5.4 80.65,40.98 79.5,42.12 v79.5,44.45 | v79.5,44.45 v79.5,81.44 | R1.1 90.5,91.43 93.02,91.43 JP4.3 | v79.5,44.45 | v79.5,81.44
  Bottom 0.152: IC1.16 56.05,34.46 66.04,44.45 v79.5,44.45 | v79.5,81.44 83.04,81.44 93.03,91.43 JP4.3
RAM_O_3  (via drill 0.35)
  Top 0.152: IC5.5 80.38,40.33 78.85,41.85 v78.85,45.09 | v78.85,45.09 v78.85,80.8 | R17.1 86.36,91.44 86.52,91.6 86.52,92.39 86.84,92.71 94.3,92.71 JP4.4 | v78.85,45.09 | v78.85,80.8
  Bottom 0.152: IC1.15 55.4,34.44 66.04,45.09 v78.85,45.09 | v78.85,80.8 83.03,80.8 92.39,90.17 94.3,90.17 JP4.4
RAM_O_4  (via drill 0.35)
  Top 0.152: IC5.6 80.11,39.68 78.2,41.58 v78.2,45.72 | v78.2,45.72 v78.2,80.17 | v78.2,45.72 | v78.2,80.17 | R2.1 JP4.5
  Bottom 0.152: IC1.14 54.75,34.43 66.04,45.72 v78.2,45.72 | v78.2,80.17 84.31,80.17 93.03,88.89 JP4.5
RAM_O_5  (via drill 0.35)
  Top 0.152: IC5.7 79.84,39.03 77.55,41.31 v77.55,46.35 | v77.55,46.35 v77.55,79.53 | R18.1 86.36,88.9 86.52,89.06 86.52,89.69 87,90.17 94.3,90.17 JP4.6 | v77.55,46.36 v77.55,46.35 | v77.55,79.53
  Bottom 0.152: IC1.13 54.1,34.41 66.04,46.36 v77.55,46.36 | v77.55,79.53 84.3,79.53 92.39,87.63 94.3,87.63 JP4.6
RAM_O_6  (via drill 0.35)
  Top 0.152: IC5.8 79.57,38.38 76.9,41.05 v76.9,46.99 | v76.9,46.99 v76.9,78.9 | R3.1 90.5,86.35 93.02,86.35 JP4.7 | v76.9,46.99
  Bottom 0.152: IC1.12 53.45,34.4 66.04,46.99 v76.9,46.99 | v76.9,78.9 85.57,78.9 JP4.7
RAM_O_7  (via drill 0.35)
  Top 0.152: IC5.9 79.3,37.73 76.25,40.78 76.25,44.45 v76.25,47.62 | v76.25,47.62 v76.25,78.11 | R19.1 86.36,86.36 86.52,86.52 86.52,87.15 87,87.63 94.3,87.63 JP4.8 | v76.25,47.63 v76.25,47.62
  Bottom 0.152: IC1.11 52.8,34.54 65.88,47.63 v76.25,47.63 | v76.25,78.11 85.41,78.11 92.39,85.09 94.31,85.09 94.31,85.1 JP4.8
RAM_O_8  (via drill 0.35)
  Top 0.152: IC6.2 81.07,32.12 75.56,37.62 75.56,44.45 v75.56,48.26 v75.56,77.47 v75.57,77.47 | R4.1 JP4.9
  Bottom 0.152: IC2.18 47.19,34.33 61.12,48.26 v75.56,48.26 | v75.57,77.47 86.69,77.47 86.69,77.48 JP4.9
RAM_O_9  (via drill 0.35)
  Top 0.152: IC6.3 80.8,31.47 74.92,37.35 74.92,44.13 v74.92,48.9 | v74.92,48.9 v74.92,76.83 v74.92,76.84 | R20.1 86.36,83.82 86.52,83.98 86.52,84.77 86.84,85.09 94.3,85.09 JP4.10 | v74.92,48.9
  Bottom 0.152: IC2.17 46.54,34.31 61.12,48.9 v74.92,48.9 | v74.92,76.84 86.68,76.84 92.39,82.55 94.3,82.55 JP4.10
RAM_O_10  (via drill 0.35)
  Top 0.152: IC6.4 80.53,30.82 74.27,37.09 v74.27,49.53 | v74.27,49.53 v74.27,76.2 | v74.27,49.53 | R5.1 JP4.11
  Bottom 0.152: IC2.16 45.89,34.3 61.12,49.53 v74.27,49.53 | v74.27,76.2 87.96,76.2 87.96,76.21 JP4.11
RAM_O_11  (via drill 0.35)
  Top 0.152: IC6.5 80.26,30.17 73.61,36.82 v73.61,50.16 | v73.61,50.16 v73.61,75.56 | R21.1 86.36,81.28 86.52,81.44 86.52,82.23 86.84,82.55 94.3,82.55 JP4.12 | v73.61,50.16 | v73.61,75.56
  Bottom 0.152: IC2.15 45.24,34.28 61.12,50.16 v73.61,50.16 | v73.61,75.56 87.95,75.56 92.39,80.01 94.31,80.01 94.31,80.02 JP4.12
RAM_O_12  (via drill 0.35)
  Top 0.152: IC6.6 79.99,29.52 72.97,36.55 v72.97,50.8 | v72.97,50.8 v72.97,74.93 | R6.1 90.5,78.73 93.02,78.73 JP4.13 | v72.97,50.8 | v72.97,74.93
  Bottom 0.152: IC2.14 44.59,34.27 61.12,50.8 v72.97,50.8 | v72.97,74.93 72.97,74.84 87.86,74.84 91.75,78.73 93.02,78.73 JP4.13
RAM_O_13  (via drill 0.35)
  Top 0.152: IC6.7 79.72,28.87 72.31,36.28 v72.31,51.44 | v72.31,51.44 v72.31,74.3 | R22.1 86.36,78.74 86.52,78.9 86.52,79.69 86.84,80.01 94.3,80.01 JP4.14 | v72.31,51.44 | v72.31,74.3
  Bottom 0.152: IC2.13 43.94,34.25 61.12,51.44 v72.31,51.44 | v72.31,74.3 72.31,74.22 88.64,74.22 91.89,77.47 94.31,77.47 94.31,77.48 JP4.14
RAM_O_14  (via drill 0.35)
  Top 0.152: IC6.8 79.45,28.22 71.67,36.01 v71.67,52.07 | v71.67,52.07 v71.67,73.66 | v71.66,52.07 v71.67,52.07 | v71.67,73.66 | R7.1 JP4.15
  Bottom 0.152: IC2.12 43.29,34.24 61.12,52.07 v71.66,52.07 | v71.67,73.66 71.73,73.6 88.45,73.6 91.04,76.19 93.02,76.19 JP4.15
RAM_O_15  (via drill 0.35)
  Top 0.152: IC6.9 79.18,27.57 71.02,35.74 v71.02,52.7 | v71.02,52.7 v71.02,73.03 | R23.1 86.36,76.2 86.52,76.36 86.52,77.15 86.84,77.47 94.3,77.47 JP4.16 | v71.01,52.71 v71.02,52.7
  Bottom 0.152: IC2.11 42.64,34.22 61.12,52.71 v71.01,52.71 | v71.02,73.03 72.07,73.03 72.18,73.13 88.42,73.13 90.22,74.93 94.31,74.93 94.31,74.94 JP4.16
RAM_O_16  (via drill 0.35)
  Top 0.152: IC7.2 81.07,21.96 70.33,32.7 70.33,39.53 v70.33,53.34 v70.33,72.39 | R8.1 90.5,73.65 93.02,73.65 JP4.17
  Bottom 0.152: IC3.18 37.03,34.17 56.2,53.34 v70.33,53.34 | v70.33,72.39 70.37,72.35 88.07,72.35 89.36,73.65 93.02,73.65 JP4.17
RAM_O_17  (via drill 0.35)
  Top 0.152: IC7.3 80.8,21.31 69.68,32.43 v69.68,53.98 | v69.68,53.98 v69.68,71.75 v69.68,71.76 | R24.1 86.36,73.66 86.52,73.82 86.52,74.61 86.84,74.93 94.3,74.93 JP4.18 | v69.68,53.98
  Bottom 0.152: IC3.17 36.38,34.15 56.2,53.98 v69.68,53.98 | v69.68,71.76 69.7,71.73 90.14,71.73 90.81,72.39 94.31,72.39 94.31,72.4 JP4.18
RAM_O_18  (via drill 0.35)
  Top 0.152: IC7.4 80.53,20.66 69.03,32.16 v69.03,54.61 | v69.03,54.61 v69.03,71.12 | v69.03,54.61 | R9.1 JP4.19
  Bottom 0.152: IC3.16 35.73,34.14 56.2,54.61 v69.03,54.61 | v69.03,71.12 69.04,71.11 69.05,71.12 JP4.19
RAM_O_19  (via drill 0.35)
  Top 0.152: IC7.5 80.26,20.01 68.38,31.89 v68.38,55.24 | v68.38,55.24 v68.38,70.48 | R25.1 86.36,71.12 86.52,71.28 86.52,72.07 86.84,72.39 94.3,72.39 JP4.20 | v68.38,55.24
  Bottom 0.152: IC3.15 35.08,34.12 56.2,55.24 v68.38,55.24 | v68.38,70.48 69.01,69.85 94.31,69.85 95.57,71.11 JP4.20
RAM_O_20  (via drill 0.35)
  Top 0.152: IC7.6 79.99,19.36 67.73,31.62 v67.73,55.88 | v67.73,55.88 v67.73,69.85 | v67.73,55.88 | R10.1 JP4.21
  Bottom 0.152: IC3.14 34.43,34.27 56.04,55.88 v67.73,55.88 | v67.73,69.85 67.73,69.12 68.28,68.57 93.02,68.57 JP4.21
RAM_O_21  (via drill 0.35)
  Top 0.152: IC7.7 79.72,18.71 67.08,31.36 v67.08,56.52 | v67.08,56.52 v67.08,69.22 | R26.1 86.36,68.58 86.52,68.74 86.52,69.53 86.84,69.85 94.3,69.85 JP4.22 | v67.08,56.52 | v67.08,69.22
  Bottom 0.152: IC3.13 33.78,34.25 56.04,56.52 v67.08,56.52 | v67.08,69.22 67.08,68.18 67.94,67.31 94.31,67.31 95.57,68.57 JP4.22
RAM_O_22  (via drill 0.35)
  Top 0.152: IC7.8 79.45,18.06 66.43,31.09 v66.43,57.15 | v66.43,57.15 v66.43,68.58 | v66.43,57.15 | v66.43,68.58 | R11.1 JP4.23
  Bottom 0.152: IC3.12 33.13,34.24 56.04,57.15 v66.43,57.15 | v66.43,68.58 66.43,67.4 67.8,66.03 67.81,66.04 JP4.23
RAM_O_23  (via drill 0.35)
  Top 0.152: IC7.9 79.18,17.41 65.78,30.82 v65.78,57.78 | v65.78,57.78 v65.78,67.94 | R27.1 86.36,66.04 86.52,66.2 86.52,66.99 86.84,67.31 94.3,67.31 JP4.24 | v65.78,57.79 v65.78,57.78
  Bottom 0.152: IC3.11 32.48,34.22 56.04,57.79 v65.78,57.79 | v65.78,67.94 65.78,65.67 66.67,64.77 94.31,64.77 95.57,66.03 JP4.24
RAM_O_24  (via drill 0.35)
  Top 0.152: IC8.2 83.56,11.8 83.4,11.96 83.4,12.64 65.09,30.96 65.09,39.05 v65.09,58.42 v65.09,67.31 | R12.1 JP4.25
  Bottom 0.152: IC4.18 26.87,34.17 51.12,58.42 v65.09,58.42 | v65.09,67.31 65.09,65.56 67.17,63.49 93.02,63.49 JP4.25
RAM_O_25  (via drill 0.35)
  Top 0.152: IC8.3 83.56,11.15 83.02,11.69 83.02,12.58 64.44,31.16 v64.44,59.05 | v64.44,59.05 v64.44,66.67 v64.44,66.68 | R28.1 86.36,63.5 86.52,63.66 86.52,64.45 86.84,64.77 94.3,64.77 JP4.26 | v64.44,59.05
  Bottom 0.152: IC4.17 26.22,34.15 51.12,59.05 v64.44,59.05 | v64.44,66.68 64.44,65.47 67.67,62.23 94.31,62.23 95.57,63.49 JP4.26
RAM_O_26  (via drill 0.35)
  Top 0.152: IC8.4 83.56,10.5 82.61,11.45 82.61,12.55 63.79,31.37 v63.79,59.69 | v63.79,59.69 v63.79,66.04 | v63.79,59.69 | R13.1 JP4.27
  Bottom 0.152: IC4.16 25.57,34.14 51.12,59.69 v63.79,59.69 | v63.79,66.04 63.79,65.21 68.05,60.95 68.06,60.96 JP4.27
RAM_O_27  (via drill 0.35)
  Top 0.152: IC8.5 83.56,9.85 82.29,11.12 82.29,12.43 63.14,31.58 v63.14,60.33 | v63.14,60.33 v63.14,65.41 | R29.1 86.36,60.96 86.52,61.12 86.52,61.91 86.84,62.23 94.3,62.23 JP4.28 | v63.14,60.33 | v63.14,65.41
  Bottom 0.152: IC4.15 24.92,34.12 51.12,60.33 v63.14,60.33 | v63.14,65.41 63.14,65.27 68.72,59.69 94.3,59.69 JP4.28
RAM_O_28  (via drill 0.35)
  Top 0.152: IC8.6 83.56,9.2 81.9,10.86 81.9,12.38 62.49,31.78 v62.49,60.96 | v62.49,60.96 v62.49,64.77 | v62.49,60.96 | R14.1 JP4.29
  Bottom 0.152: IC4.14 24.27,34.27 50.96,60.96 v62.49,60.96 | v62.49,64.77 62.89,64.77 69.25,58.41 93.02,58.41 JP4.29
RAM_O_29  (via drill 0.35)
  Top 0.152: IC8.7 83.4,8.55 81.47,10.48 81.47,12.36 61.84,31.99 v61.84,61.59 | v61.84,61.59 v61.84,64.14 | R30.1 86.36,58.42 86.52,58.58 86.52,59.37 86.84,59.69 94.3,59.69 JP4.30 | v61.84,61.6 v61.84,61.59
  Bottom 0.152: IC4.13 23.62,34.25 50.96,61.6 v61.84,61.6 | v61.84,64.14 62.77,64.14 69.76,57.15 94.31,57.15 95.57,58.41 JP4.30
RAM_O_30  (via drill 0.35)
  Top 0.152: IC8.8 83.56,7.9 81.02,10.44 81.02,12.21 61.19,32.04 v61.19,62.23 | v61.19,62.23 v61.19,63.5 | v61.19,62.23 | v61.19,63.5 | R15.1 JP4.31
  Bottom 0.152: IC4.12 22.97,34.24 50.96,62.23 v61.19,62.23 | v61.19,63.5 62.66,63.5 70.29,55.87 70.31,55.88 JP4.31
RAM_O_31  (via drill 0.35)
  Top 0.152: IC8.9 83.56,7.25 80.7,10.11 80.7,12.08 60.54,32.25 v60.54,62.87 | R31.1 86.36,55.88 86.52,56.04 86.52,56.83 86.84,57.15 94.3,57.15 JP4.32
  Bottom 0.152: IC4.11 22.32,34.22 50.96,62.87 v60.54,62.87 62.55,62.87 70.8,54.61 94.31,54.61 95.57,55.87 JP4.32
RB1_0
  Top 0.152: JP5.7 5.71,87.63 8.57,87.63 JP3.7
RB1_1
  Top 0.152: JP5.8 8.1,85.25 11.27,85.25 JP3.8
RB1_2
  Top 0.152: JP3.9 8.72,84.94 5.57,84.94 JP5.9
RB1_3
  Top 0.152: JP5.10 8.1,82.71 11.27,82.71 JP3.10
RB1_4
  Top 0.152: JP3.11 8.72,82.4 5.57,82.4 JP5.11
RB1_5
  Top 0.152: JP5.12 8.1,80.17 11.27,80.17 JP3.12
RB1_6
  Top 0.152: JP3.13 8.72,79.86 5.57,79.86 JP5.13
RB1_7
  Top 0.152: JP5.14 8.1,77.63 11.27,77.63 JP3.14
RB1_8
  Top 0.152: JP3.15 8.72,77.32 5.57,77.32 JP5.15
RB1_9
  Top 0.152: JP5.16 8.1,75.09 11.27,75.09 JP3.16
RB1_10
  Top 0.152: JP3.17 8.72,74.78 5.57,74.78 JP5.17
RB1_11
  Top 0.152: JP5.18 8.1,72.55 11.27,72.55 JP3.18
RB1_12
  Top 0.152: JP3.19 8.72,72.24 5.57,72.24 JP5.19
RB1_13
  Top 0.152: JP5.20 8.1,70.01 11.27,70.01 JP3.20
RB1_14
  Top 0.152: JP3.21 8.72,69.7 5.57,69.7 JP5.21
RB1_15
  Top 0.152: JP5.22 8.1,67.47 11.27,67.47 JP3.22
RB1_16
  Top 0.152: JP3.23 8.72,67.16 5.57,67.16 JP5.23
RB1_17
  Top 0.152: JP5.24 8.1,64.93 11.27,64.93 JP3.24
RB1_18
  Top 0.152: JP3.25 8.72,64.62 5.57,64.62 JP5.25
RB1_19
  Top 0.152: JP5.26 8.1,62.39 11.27,62.39 JP3.26
RB1_20
  Top 0.152: JP3.27 8.72,62.08 5.57,62.08 JP5.27
RB1_21
  Top 0.152: JP5.28 8.1,59.85 11.27,59.85 JP3.28
RB1_22
  Top 0.152: JP3.29 8.72,59.54 5.57,59.54 JP5.29
RB1_23
  Top 0.152: JP5.30 8.1,57.31 11.27,57.31 JP3.30
RB1_24
  Top 0.152: JP3.31 8.73,56.99 5.56,56.99 JP5.31
RB1_25
  Top 0.152: JP5.32 8.1,54.77 11.27,54.77 JP3.32
RB1_26
  Top 0.152: JP3.33 8.72,54.46 5.57,54.46 JP5.33
RB1_27
  Top 0.152: JP5.34 8.1,52.23 11.27,52.23 JP3.34
RB1_28
  Top 0.152: JP3.35 8.72,51.92 5.57,51.92 JP5.35
RB1_29
  Top 0.152: JP5.36 8.1,49.69 11.27,49.69 JP3.36
RB1_30
  Top 0.152: JP3.37 8.72,49.38 5.57,49.38 JP5.37
RB1_31
  Top 0.152: JP5.38 8.26,46.99 11.11,46.99 JP3.38
RTB_0
  Top 0.152: IC5.19 91.17,42.28 OUT.1
RTB_1
  Top 0.152: IC5.18 91.16,41.63 92.39,42.86 94.3,42.86 OUT.2
RTB_2
  Top 0.152: IC5.17 92.42,40.98 OUT.3
RTB_3
  Top 0.152: IC5.16 92.39,40.33 92.39,40.32 94.3,40.32 OUT.4
RTB_4
  Top 0.152: IC5.15 92.4,39.68 OUT.5
RTB_5
  Top 0.152: IC5.14 91.14,39.03 92.39,37.78 94.3,37.78 OUT.6
RTB_6
  Top 0.152: IC5.13 91.16,38.38 OUT.7
RTB_7
  Top 0.152: IC5.12 91.17,37.73 91.76,37.15 91.76,35.88 92.39,35.24 94.3,35.24 OUT.8
RTB_8
  Top 0.152: IC6.19 91.17,32.12 OUT.9
RTB_9
  Top 0.152: IC6.18 91.16,31.47 92.39,32.7 94.3,32.7 OUT.10
RTB_10
  Top 0.152: IC6.17 92.42,30.82 OUT.11
RTB_11
  Top 0.152: IC6.16 92.39,30.17 92.39,30.16 94.3,30.16 OUT.12
RTB_12
  Top 0.152: IC6.15 92.4,29.52 OUT.13
RTB_13
  Top 0.152: IC6.14 91.14,28.87 92.39,27.62 94.3,27.62 OUT.14
RTB_14
  Top 0.152: IC6.13 91.16,28.22 OUT.15
RTB_15
  Top 0.152: IC6.12 91.17,27.57 91.76,26.99 91.76,25.72 92.39,25.08 94.3,25.08 OUT.16
RTB_16
  Top 0.152: IC7.19 91.17,21.96 OUT.17
RTB_17
  Top 0.152: IC7.18 91.16,21.31 92.39,22.54 94.3,22.54 OUT.18
RTB_18
  Top 0.152: IC7.17 92.42,20.66 OUT.19
RTB_19
  Top 0.152: IC7.16 92.39,20.01 92.39,20 94.3,20 OUT.20
RTB_20
  Top 0.152: IC7.15 92.4,19.36 OUT.21
RTB_21
  Top 0.152: IC7.14 91.14,18.71 92.39,17.46 94.3,17.46 OUT.22
RTB_22
  Top 0.152: IC7.13 91.16,18.06 OUT.23
RTB_23
  Top 0.152: IC7.12 91.17,17.41 91.76,16.83 91.76,15.56 92.39,14.92 94.3,14.92 OUT.24
RTB_24
  Top 0.152: IC8.19 91.17,11.8 OUT.25
RTB_25
  Top 0.152: IC8.18 91.16,11.15 92.39,12.38 94.3,12.38 OUT.26
RTB_26
  Top 0.152: IC8.17 92.42,10.5 OUT.27
RTB_27
  Top 0.152: IC8.16 92.39,9.85 92.39,9.84 94.3,9.84 OUT.28
RTB_28
  Top 0.152: IC8.15 92.4,9.2 OUT.29
RTB_29
  Top 0.152: IC8.14 91.14,8.55 92.39,7.3 94.3,7.3 OUT.30
RTB_30
  Top 0.152: IC8.13 91.16,7.9 OUT.31
RTB_31
  Top 0.152: IC8.12 91.17,7.25 91.76,6.67 91.76,5.4 92.39,4.76 94.3,4.76 OUT.32
VCC  (via drill 0.35)
  Top 0.305: IC5.20 v87.31,42.93 | v87.31,22.54 v87.31,32.7 87.31,32.86 | 87.31,32.86 v87.31,42.93 | IC7.20 87.38,22.61 v87.31,22.54 | IC6.20 87.4,32.77 87.31,32.86 | IC8.20 88.67,12.45 87.31,13.81 v87.31,14.61 v87.31,22.54 | v87.31,42.93 87.31,43.5 v86.52,44.29 | v20.32,30.32 19.21,30.32 | C1.1 28.17,31.84 v28.17,30.32 | C2.1 38.33,31.84 v38.33,30.32 | C3.1 48.49,31.84 v48.49,30.32 | C4.1 57.31,31.75 v58.65,31.75
  Top 1.27: JP2.10 78.26,6.99 79.69,8.41 79.69,10.16 JP1.12 | JP2.10 JP2.9 | PWR.3 PWR.4 PWR.2 | PWR.2 PWR.1 19.21,30.32 C9.1 19.21,65.72 21.56,68.07 C12.+ 21.56,88.87 | PWR.2 20.8,9.84 21.75,8.89 JP2.10 | JP3.5 JP3.6 21.53,88.9 21.56,88.87 | JP3.3 JP3.5 | JP3.5 JP5.6 JP5.5 JP5.3 | 58.74,88.9 21.59,88.9 21.56,88.87 | 58.74,88.9 68.4,88.9 PWR1.1 | PWR3.3 PWR3.4 | PWR3.2 PWR3.1 PWR3.3 | PWR1.2 PWR1.1 | PWR1.1 PWR1.3 PWR1.4 | C10.1 JP4.37 | PWR3.3 C11.1 58.74,88.9
  Bottom 0.305: IC4.1 v28.17,30.32 | v28.17,30.32 IC4.20 | IC3.20 v38.33,30.32 | IC3.1 v38.33,30.32 | IC2.1 v48.49,30.32 | IC2.20 v48.49,30.32 | v38.33,30.32 v28.17,30.32 | v38.33,30.32 v48.49,30.32 | IC1.20 v58.65,31.75 58.65,30.32 | 58.65,30.32 IC1.1 | v48.49,30.32 58.65,30.32 | v86.52,44.29 85.57,45.24 | v28.17,30.32 v20.32,30.32 | C8.1 87.31,13.49 v87.31,14.61 | C7.1 v87.31,22.54 | C6.1 v87.31,32.7 | C5.1 v87.31,42.93
  Bottom 1.27: JP4.36 JP4.38 JP4.37 88.58,48.26 85.57,45.24 77.47,37.15 JP1.12

### Text on the board
tNames: R0-R31 | TRANSPORT LAYER / SZKANDERA 2020